# Altium project DelibirdV1.PrjPcb
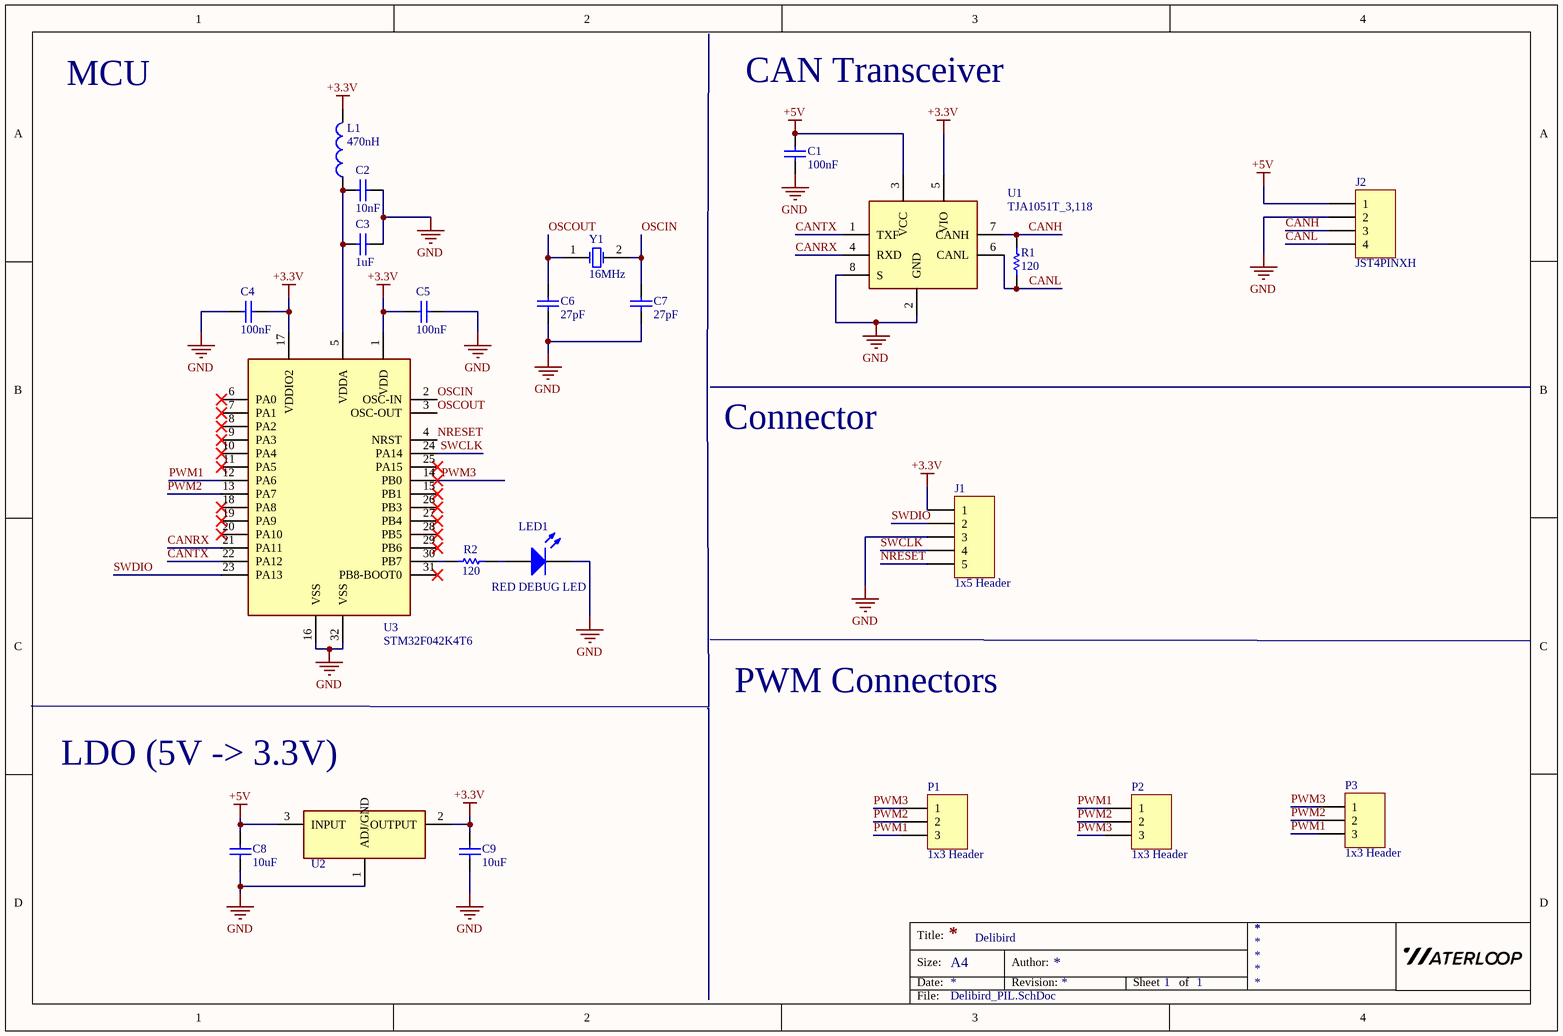
[diagram p0: Delibird_PIL.SchDoc]
1 sheet, 22 parts. Net scope: global (net labels, ports and power ports of the same name join across sheets).

## Sheet Delibird_PIL.SchDoc
size A4; SheetNumber: 1; SheetTotal: 1

### Parts
C1  value 100nF  [0805 - Capacitor]  (hidden comment: Capacitor - Nonpolarized)
C2  value 10nF  [0805 - Capacitor]  (hidden comment: Capacitor - Nonpolarized)
C3  value 1uF  [0805 - Capacitor]  (hidden comment: Capacitor - Nonpolarized)
C4  value 100nF  [0805 - Capacitor]  (hidden comment: Capacitor - Nonpolarized)
C5  value 100nF  [0805 - Capacitor]  (hidden comment: Capacitor - Nonpolarized)
C6  value 27pF  [0805 - Capacitor]  (hidden comment: Capacitor - Nonpolarized)
C7  value 27pF  [0805 - Capacitor]  (hidden comment: Capacitor - Nonpolarized)
C8  value 10uF  [0805 - Capacitor]  (hidden comment: Capacitor - Nonpolarized)
C9  value 10uF  [0805 - Capacitor]  (hidden comment: Capacitor - Nonpolarized)
J1  1x5 Header  [HDR1X5]  (no BOM)
J2  JST4PINXH  [B4B-XH]  (no BOM)
L1  value 470nH  [0805 - Capacitor]  (hidden comment: Inductor)
LED1  RED DEBUG LED  [0805 - Resistor]
P1  1x3 Header  [B3B-XH]
P2  1x3 Header  [B3B-XH]
P3  1x3 Header  [B3B-XH]
R1  value 120  [0603 - Resistor]  (hidden comment: Resistor)
R2  value 120  [0603 - Resistor]  (hidden comment: Resistor)
U1  TJA1051T_3,118  [TJA1051T/3,118]  (no BOM)
U2  TLV1117-33IDCYR  [TLV1117]  (value not drawn)  (no BOM)
U3  STM32F042K4T6  [QFP80P900X900X160-32N]  (no BOM)
Y1  value 16MHz  [2-SMD NO LEAD CRSYSTAL]  (hidden comment: Oscillator)

### Nets
+3.3V: C4.1 C5.2 C9.2 J1.1 L1.2 U1.5(VIO) U2.2(OUTPUT) U3.1(VDD) U3.17(VDDIO2)
+5V: C1.2 C8.1 J2.1 U1.3(VCC) U2.3(INPUT)
GND: C1.1 C2.2 C3.2 C4.2 C5.1 C6.1 C7.1 C8.2 C9.1 J1.3 J2.2 LED1.2(K) U1.2(GND) U1.8(S) U2.1(ADJ/GND) U3.16(VSS) U3.32(VSS)
CANH: J2.3 R1.2 U1.7(CANH)
CANL: J2.4 R1.1 U1.6(CANL)
CANRX: U1.4(RXD) U3.21(PA11)
CANTX: U1.1(TXF) U3.22(PA12)
NRESET: J1.5 U3.4(NRST)
OSCIN: C7.2 U3.2(OSC-IN) Y1.2(OSC2)
OSCOUT: C6.2 U3.3(OSC-OUT) Y1.1(OSC1)
PWM1: P1.3 P2.1 P3.3 U3.12(PA6)
PWM2: P1.2 P2.2 P3.2 U3.13(PA7)
PWM3: P1.1 P2.3 P3.1 U3.14(PB0)
SWCLK: J1.4 U3.24(PA14)
SWDIO: J1.2 U3.23(PA13)
NetC2_1: C2.1 C3.1 L1.1 U3.5(VDDA)
NetLED1_1: LED1.1(A) R2.2
NetR2_1: R2.1 U3.30(PB7)

Not connected (* = marked no-connect by the designer): U3 6(PA0)* 7(PA1)* 8(PA2)* 9(PA3)* 10(PA4)* 11(PA5)* 15(PB1)* 18(PA8)* 19(PA9)* 20(PA10)* 25(PA15)* 26(PB3)* 27(PB4)* 28(PB5)* 29(PB6)* 31(PB8-BOOT0)*

### Notes on the sheet
- MCU
- CAN Transceiver
- Connector
- PWM Connectors
- LDO (5V -> 3.3V)
- Delibird
- Title:
- Size:
- Date:
- A4
- Author:
- Revision:
- Sheet
- of
- File:

### Library data of the parts
C1-C9 = Capacitor - Nonpolarized: Nonpolarized Capacitor; Supplier Part Number: *; Supplier: *; Manufacturer: *; Rating: *; Manufacturer Part Number: *
J1 = 1x5 Header: 1x5 Pin Header
J2 = 1x4 Header: 1x4 Pin Header
LED1 = LED: Light Emitting Diode; Value: *; Manufacturer Part Number: *; Manufacturer: *; Supplier Part Number: *; Rating: *; Supplier: *
P1-P3 = 1x3 Header: 1x3 Pin Header
U1 = TJA1051T_3,118: CAN Transceiver IC 4.5V-5.5V 250ns; Manufacturer: NXP; Datasheet: http://www.nxp.com/docs/en/data-sheet/TJA1051.pdf; Manufacturer Part Number: TJA1051T/3,118; Supplier Part Number: 568-8684-1-ND; Supplier: Digikey; ComponentLink1Description: Datasheet; ComponentLink1URL: http://www.nxp.com/docs/en/data-sheet/TJA1051.pdf
U2 = TLV1117-33IDCYR: Linear Voltage Regulator IC 3.3V 800MA SOT223-4; Manufacturer: Texas Instruments; Manufacturer Part Number: TLV1117-33IDCYR; Supplier Part Number: 296-21112-1-ND; Supplier: Digikey; ComponentLink1Description: Datasheet; ComponentLink1URL: http://www.ti.com/lit/ds/symlink/tlv1117.pdf?HQS=TI-null-null-digikeymode-df-pf-null-wwe&ts=1590668900314
U3 = STM32F042K4T6: Microcontroller; Manufacturer_Name: STMicroelectronics; Height: 1.6mm; Manufacturer_Part_Number: STM32F042K4T6; Mouser Part Number: 511-STM32F042K4T6; Mouser Price/Stock: https://www.mouser.co.uk/ProductDetail/STMicroelectronics/STM32F042K4T6?qs=ClYTdQWm4hDAfZj5dd9NhA%3D%3D; ComponentLink1Description: Datasheet; ComponentLink1URL: https://www.mouser.com/datasheet/2/389/stm32f042c4-956225.pdf
Y1 = Oscillator: Crystal Oscillator; Manufacturer Part Number: *; Manufacturer: *; Supplier Part Number: *; Supplier: *; Rating: *
L1 = Inductor: Rating: *; Manufacturer Part Number: *; Supplier Part Number: *; Supplier: *; Manufacturer: *
R1 R2 = Resistor: Rating: *; Manufacturer Part Number: *; Manufacturer: *; Supplier Part Number: *; Supplier: *